# Altium schematic sheet Mach dieu khien tu xa.SchDoc: Bài 4: Mạch điều khiển từ xa
size A3; Revision: 1.0; SheetNumber: 01; SheetTotal: 02
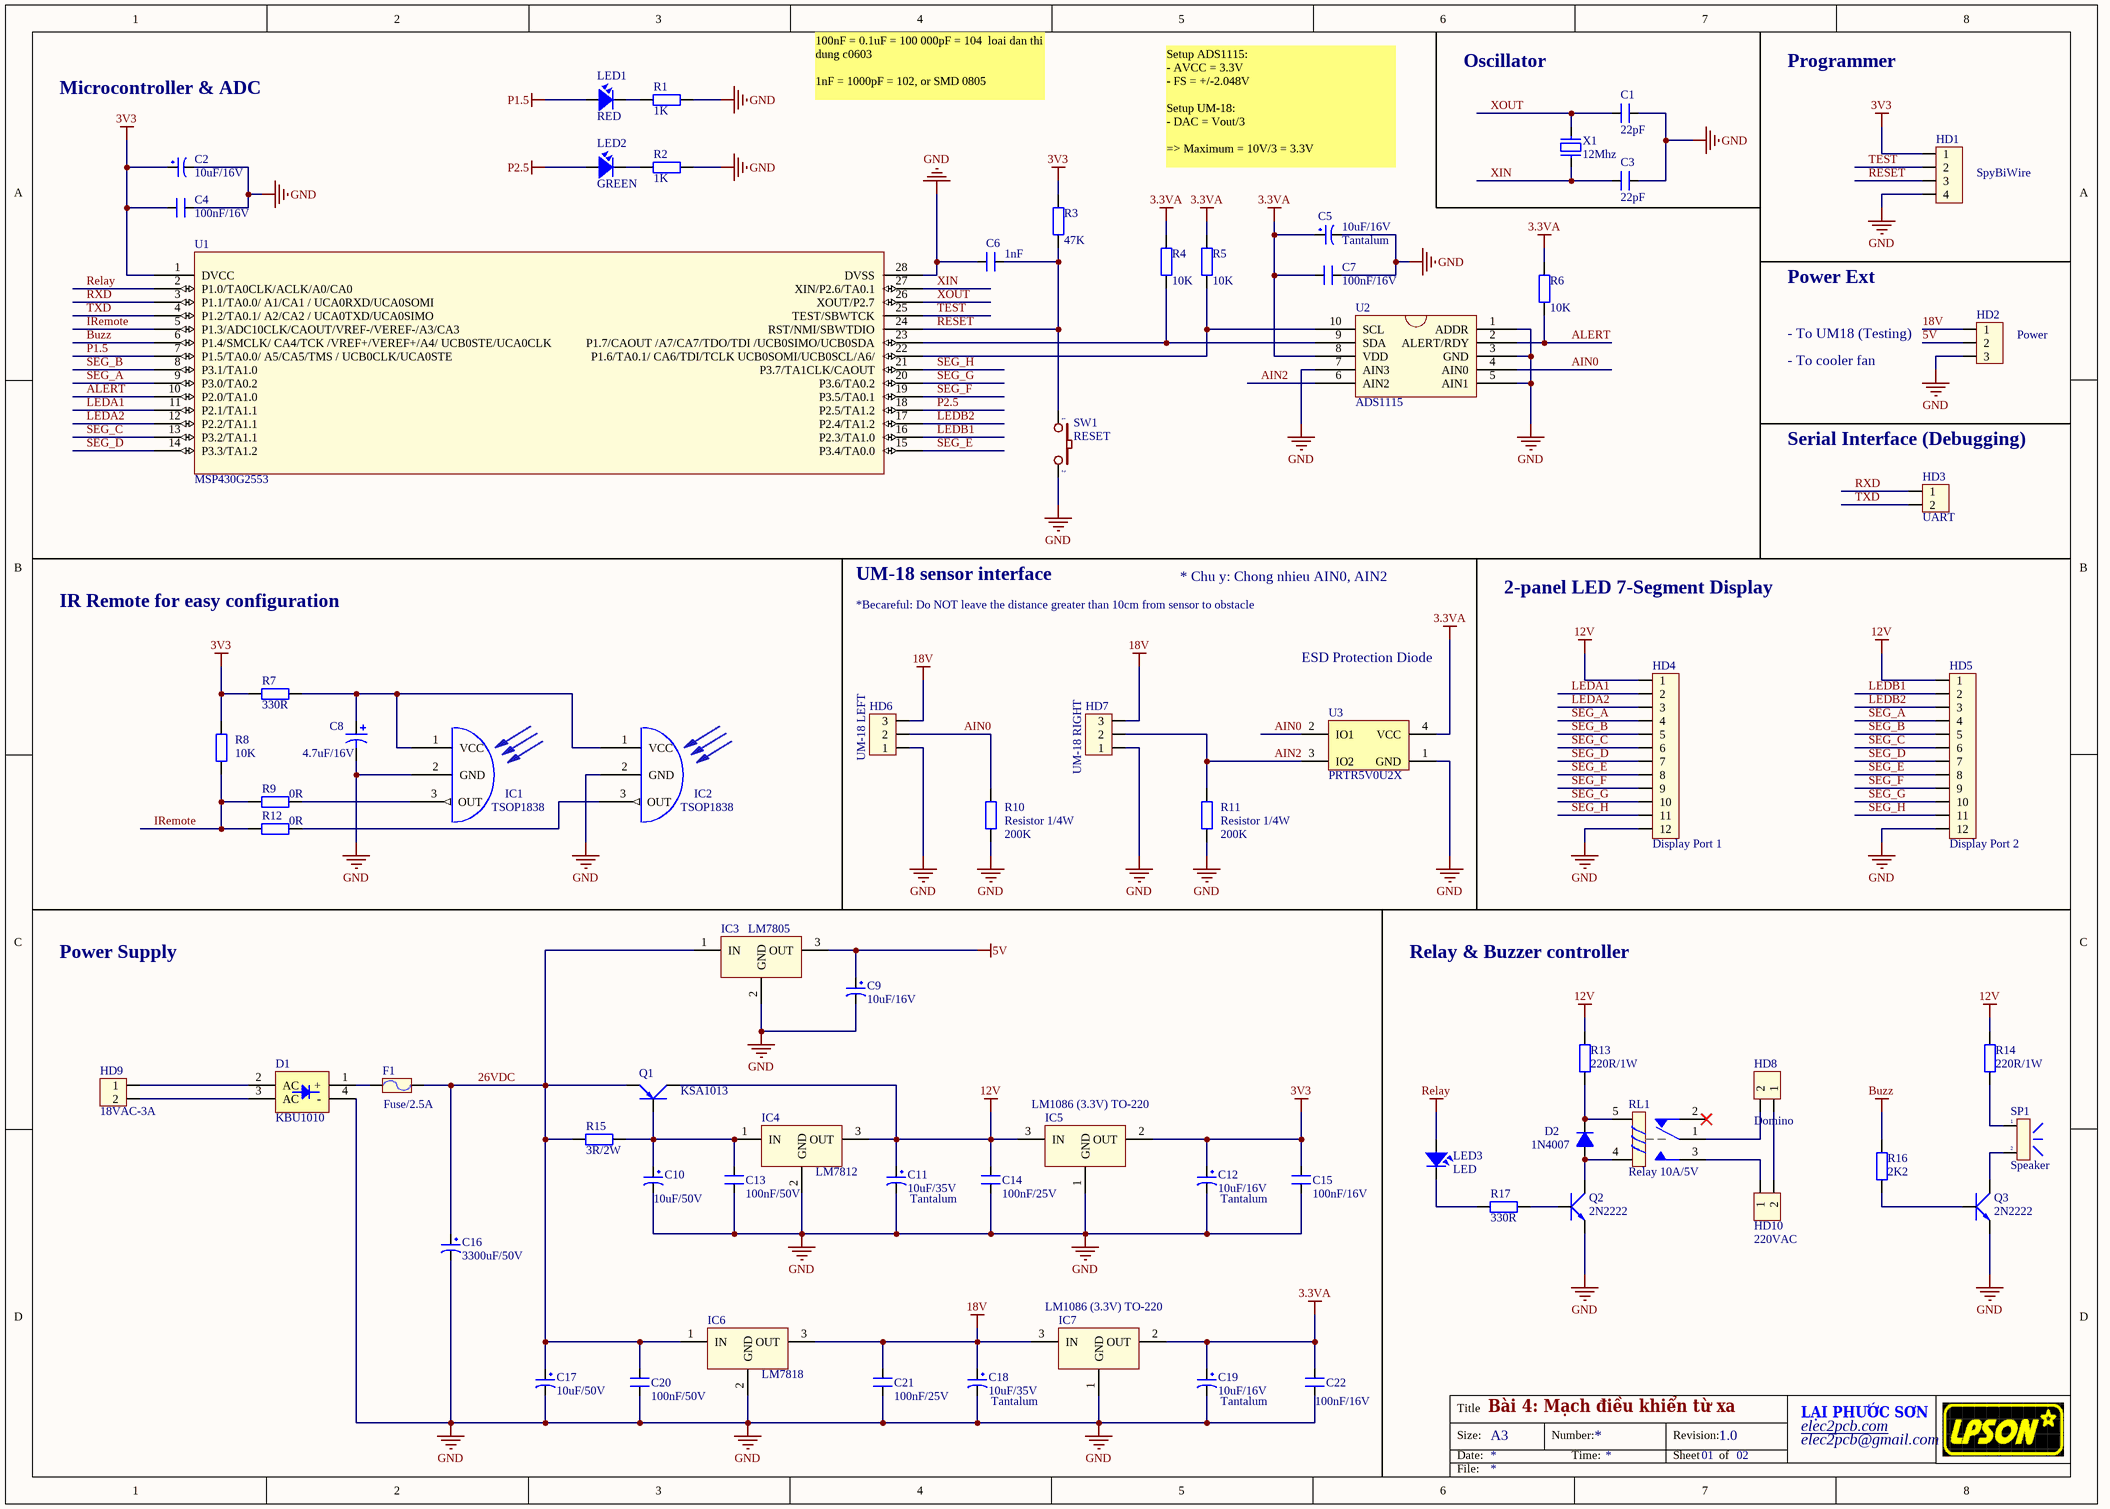
[diagram p0: Mach dieu khien tu xa.SchDoc]

## Parts
C1  22pF  [C0603]
C2  10uF/16V  [C0805]
C3  22pF  [C0603]
C4  100nF/16V  [Tu gom 104]
C5  10uF/16V  Type: Tantalum  [CAP_TANTA_10UF_16V]
C6  1nF  [C0805]
C7  100nF/16V  [Tu gom 104]
C8  value 4.7uF/16V  [C0805]  (hidden comment: Cap Pol1)
C9  10uF/16V  [CAP_10UF_16V]
C10  10uF/50V  [C_FC_10UF_50V]
C11  10uF/35V  Type: Tantalum  [CAP_TANTA_10UF_35V]
C12  10uF/16V  Type: Tantalum  [CAP_TANTA_10UF_16V]
C13  100nF/50V  [Tu gom 104]
C14  100nF/25V  [Tu gom 104]
C15  100nF/16V  [Tu gom 104]
C16  3300uF/50V  [CAP_3300UF_50V]
C17  10uF/50V  [C_FC_10UF_50V]
C18  10uF/35V  Type: Tantalum  [CAP_TANTA_10UF_35V]
C19  10uF/16V  Type: Tantalum  [CAP_TANTA_10UF_16V]
C20  100nF/50V  [Tu gom 104]
C21  100nF/25V  [Tu gom 104]
C22  100nF/16V  [Tu gom 104]
D1  KBU1010  [KBU1010G]
D2  1N4007  [1N4007]
F1  Fuse/2.5A  [FUSE2_5A]
HD1  SpyBiWire  [Header_4]
HD2  Power  [CON3]
HD3  UART  [Header_2]
HD4  Display Port 1  [CON12]
HD5  Display Port 2  [CON12]
HD6  UM-18 LEFT  [CON3]
HD7  UM-18 RIGHT  [CON3]
HD8  Domino  [DOMINO2_GREEN]
HD9  18VAC-3A  [DOMINO2_GREEN]
HD10  220VAC  [DOMINO2_GREEN]
IC1  TSOP1838  [TSOP1838]
IC2  TSOP1838  [TSOP1838]
IC3  LM7805  [LM7805]
IC4  LM7812  [LM7805]
IC5  LM1086 (3.3V) TO-220  [LM1086]
IC6  LM7818  [LM7805]
IC7  LM1086 (3.3V) TO-220  [LM1086]
LED1  RED  [LED3R]
LED2  GREEN  [LED3R]
LED3  LED  [LED3R]
Q1  KSA1013  [KSA1013]
Q2  2N2222  [2N2222]
Q3  2N2222  [2N2222]
R1  value 1K  [RESC2012(0805)]  (hidden comment: Res2)
R2  value 1K  [RESC2012(0805)]  (hidden comment: Res2)
R3  value 47K  [RESC2012(0805)]  (hidden comment: Res2)
R4  value 10K  [RESC2012(0805)]  (hidden comment: Res2)
R5  value 10K  [RESC2012(0805)]  (hidden comment: Res2)
R6  value 10K  [RESC2012(0805)]  (hidden comment: Res2)
R7  value 330R  [RESC2012(0805)]  (hidden comment: Res2)
R8  value 10K  [RESC2012(0805)]  (hidden comment: Res2)
R9  value 0R  [RESC2012(0805)]  (hidden comment: Res2)
R10  Resistor 1/4W  value 200K  [RESC2012(0805)]
R11  Resistor 1/4W  value 200K  [RESC2012(0805)]
R12  value 0R  [RESC2012(0805)]  (hidden comment: Res2)
R13  value 220R/1W  [CFR1WS]  (hidden comment: Res2)
R14  value 220R/1W  [CFR1WS]  (hidden comment: Res2)
R15  value 3R/2W  [R2WD]  (hidden comment: Res2)
R16  value 2K2  [RES 1/4W CFR25]  (hidden comment: Res2)
R17  value 330R  [RES 1/4W CFR25]  (hidden comment: Res2)
RL1  Relay 10A/5V  [RL_10A_5V]
SP1  Speaker  [SPEAKER]
SW1  RESET  [BUTTON 2PIN TRON]
U1  MSP430G2553  [MSP430G2253IPW28R]
U2  ADS1115  [ADS1115]
U3  PRTR5V0U2X  [PRTR5V0U2X]
X1  12Mhz  [CRYSTAL]

## Nets
3.3VA: C5.1 C7.2 C19.1 C22.2 IC7.2(OUT) R4.2 R5.2 R6.2 U2.8(VDD) U3.4(VCC)
3V3: C2.1 C4.2 C12.1 C15.2 HD1.1 IC5.2(OUT) R3.2 R7.2 R8.2 U1.1(DVCC)
5V: C9.1 HD2.2 IC3.3(OUT)
12V: C11.1 C14.2 HD4.1 HD5.1 IC4.3(OUT) IC5.3(IN) Q1.2(C) R13.1 R14.1
18V: C18.1 C21.2 HD2.1 HD6.3 HD7.3 IC6.3(OUT) IC7.3(IN)
Buzz: R16.1 U1.6(P1.4/SMCLK/_CA4/TCK_/VREF+/VEREF+/A4/_UCB0STE/UCA0CLK)
GND: C1.1 C2.2 C3.1 C4.1 C5.2 C6.1 C7.1 C8.2 C9.2 C10.2 C11.2 C12.2 C13.1 C14.1 C15.1 C16.2 C17.2 C18.2 C19.2 C20.1 C21.1 C22.1 D1.4(-) HD1.4 HD2.3 HD4.12 HD5.12 HD6.1 HD7.1 IC1.2(GND) IC2.2(GND) IC3.2(GND) IC4.2(GND) IC5.1(GND) IC6.2(GND) IC7.1(GND) Q2.1(E) Q3.1(E) R1.1 R2.1 R10.2 R11.2 SW1.2 U1.28(DVSS) U2.1(ADDR) U2.3(GND) U2.5(AIN1) U2.7(AIN3) U3.1(GND)
P1.5: LED1.1 U1.7(P1.5/TA0.0/_A5/CA5/TMS_/_UCB0CLK/UCA0STE)
P2.5: LED2.1 U1.18(P2.5/TA1.2)
Relay: LED3.1 U1.2(P1.0/TA0CLK/ACLK/A0/CA0)
26VDC: C16.1 C17.1 C20.2 F1.2 IC3.1(IN) IC6.1(IN) Q1.1(E) R15.2
AIN0: HD6.2 R10.1 U2.4(AIN0) U3.2(IO1)
AIN2: HD7.2 R11.1 U2.6(AIN2) U3.3(IO2)
ALERT: R6.1 U1.10(P2.0/TA1.0) U2.2(ALERT/RDY)
IRemote: R8.1 R9.2 R12.2 U1.5(P1.3/ADC10CLK/CAOUT/VREF-/VEREF-/A3/CA3)
LEDA1: HD4.2 U1.11(P2.1/TA1.1)
LEDA2: HD4.3 U1.12(P2.2/TA1.1)
LEDB1: HD5.2 U1.16(P2.3/TA1.0)
LEDB2: HD5.3 U1.17(P2.4/TA1.2)
RESET: C6.2 HD1.3 R3.1 SW1.1 U1.24(RST/NMI/SBWTDIO)
RXD: HD3.1 U1.3(P1.1/TA0.0/_A1/CA1_/_UCA0RXD/UCA0SOMI)
SEG_A: HD4.4 HD5.4 U1.9(P3.0/TA0.2)
SEG_B: HD4.5 HD5.5 U1.8(P3.1/TA1.0)
SEG_C: HD4.6 HD5.6 U1.13(P3.2/TA1.1)
SEG_D: HD4.7 HD5.7 U1.14(P3.3/TA1.2)
SEG_E: HD4.8 HD5.8 U1.15(P3.4/TA0.0)
SEG_F: HD4.9 HD5.9 U1.19(P3.5/TA0.1)
SEG_G: HD4.10 HD5.10 U1.20(P3.6/TA0.2)
SEG_H: HD4.11 HD5.11 U1.21(P3.7/TA1CLK/CAOUT)
TEST: HD1.2 U1.25(TEST/SBWTCK)
TXD: HD3.2 U1.4(P1.2/TA0.1/_A2/CA2_/_UCA0TXD/UCA0SIMO)
XIN: C3.2 U1.27(XIN/P2.6/TA0.1) X1.2
XOUT: C1.2 U1.26(XOUT/P2.7) X1.1
NetC8_1: C8.1 IC1.1(VCC) IC2.1(VCC) R7.1
NetC10_1: C10.1 C13.2 IC4.1(IN) Q1.3(B) R15.1
NetD1_1: D1.1(+) F1.1
NetD1_2: D1.2(AC) HD9.1
NetD1_3: D1.3(AC) HD9.2
NetD2_1: D2.1(A) Q2.3(C) RL1.4
NetD2_2: D2.2(K) R13.2 RL1.5
NetHD8_1: HD8.1 HD10.2
NetHD8_2: HD8.2 RL1.1
NetHD10_1: HD10.1 RL1.3
NetIC1_3: IC1.3(OUT) R9.1
NetIC2_3: IC2.3(OUT) R12.1
NetLED1_2: LED1.2 R1.2
NetLED2_2: LED2.2 R2.2
NetLED3_2: LED3.2 R17.2
NetQ2_2: Q2.2(B) R17.1
NetQ3_2: Q3.2(B) R16.2
NetQ3_3: Q3.3(C) SP1.2
NetR4_1: R4.1 U1.23(P1.7/CAOUT_/A7/CA7/TDO/TDI_/UCB0SIMO/UCB0SDA) U2.9(SDA)
NetR5_1: R5.1 U1.22(P1.6/TA0.1/_CA6/TDI/TCLK_UCB0SOMI/UCB0SCL/A6/) U2.10(SCL)
NetR14_2: R14.2 SP1.1

Not connected (* = marked no-connect by the designer): RL1 2*

## Notes on the sheet
- Microcontroller & ADC
- 100nF = 0.1uF = 100 000pF = 104  loai dan thi dung c0603
  1nF = 1000pF = 102, or SMD 0805
- Oscillator
- Programmer
- Setup ADS1115:
  - AVCC = 3.3V
  - FS = +/-2.048V
  Setup UM-18:
  - DAC = Vout/3
  => Maximum = 10V/3 = 3.3V
- Power Ext
- (near HD2) - To UM18 (Testing)
- - To cooler fan
- (near HD3) Serial Interface (Debugging)
- UM-18 sensor interface
- * Chu y: Chong nhieu AIN0, AIN2
- IR Remote for easy configuration
- *Becareful: Do NOT leave the distance greater than 10cm from sensor to obstacle
- 2-panel LED 7-Segment Display
- ESD Protection Diode
- Power Supply
- Relay & Buzzer controller
- Title
- Size:
- Date:
- A3
- Number:
- Time:
- Revision:
- Sheet
- of
- LẠI PHƯỚC SƠN
- elec2pcb@gmail.com
- elec2pcb.com
- File:

## Library data of the parts
C1 C3 = CN1: 0805-SMD Capacitor; Value: 22pF
C2 C16 = CP1: Cap P  0,1uF < 22uF , 16 - 50V; Value: 10uF/50V; Description 1: 10 => 220uF/6,3V/10V - 10uF => 100uF/16V; Description 2: 0,1uF => 33uF/50V - 10uF => 22uF/63V; Description 3: 0,47uF => 10uF/100V
C4 C7 C13-C15 C20-C22 = CN2: Cap np 104 => 105pF; Value: 0.1uF
C5 C11 C12 C18 C19 = CP1: Tantalum Capacitor; datasheet: http://www.kemet.com/Lists/ProductCatalog/Attachments/254/KEM_T2005_T491.pdf
  C5 C12 C19: digikey: http://www.digikey.com/product-detail/en/T491A106M016AT/399-3687-1-ND/819012
  C11 C18: digikey: http://www.digikey.com/product-detail/en/T491C106K025AT/399-3734-1-ND/819059
C6 = CN2: Cap np 104 => 105pF; Value: 1nF
C8 = Cap Pol1: Polarized Capacitor (Radial); Published: 8-Jun-2000; LatestRevisionDate: 17-Jul-2002; LatestRevisionNote: Re-released for DXP Platform.; PackageReference: RB7.6-15; Publisher: Altium Limited; PackageDescription: Polarized Capacitor (Radial); 2 Leads
C9 C17 = CP1: Aluminium Capacitor
C10 = CP1: Aluminium Capacitor; Description 1: 10 => 220uF/6,3V/10V - 10uF => 100uF/16V; Description 2: 0,1uF => 33uF/50V - 10uF => 22uF/63V; Description 3: 0,47uF => 10uF/100V
D1 = KBU1010: 10A glass passivated bridge rectifier; Digikey: http://www.digikey.com/product-detail/en/KBU1010-G/641-1359-ND/2074824; datasheet: http://www.comchiptech.com/cms/UserFiles/KBU10005-G%20Thru.%20KBU1010-G%20Series%20RevA.pdf
D2 = D1A: Diode 1A; Value: 1N4007
F1 = Fuse: Designed by: VanDungEvn; Value: Fuse
HD1 = Hed4: Header 4 (Green); Value: Header 4
HD2 HD6 HD7 = Hed3: Header 3 (Green); Value: Header 3
HD3 HD8-HD10 = Hed2: Header 2 (Green); Value: Header 2
HD4 HD5 = Hed12: Header 12; Value: Header 5
IC3 IC5-IC7 = LM78xx: Linear Regulator
  IC3: Value: LM7805; digikey: http://www.digikey.com/product-detail/en/LM7805CT/LM7805CT-ND/458698; datasheet: http://www.fairchildsemi.com/ds/LM/LM7805.pdf
  IC5 IC7: Value: LM1086 (3.3V); digikey: http://www.digikey.com/product-detail/en/LM1086CSX-3.3%2FNOPB/LM1086CSX-3.3%2FNOPBCT-ND/3440095; datasheet: http://www.ti.com/lit/ds/symlink/lm1086.pdf
  IC6: Value: LM7818; digikey: http://www.digikey.com/product-detail/en/LM7818CT/LM7818CT-ND/1923054; datasheet: http://www.fairchildsemi.com/ds/LM/LM7805.pdf
IC4 = LM78xx: Linear Regulator; Manufacturer: Fairchild Semiconductor; Value: LM7812; Digikey: http://www.digikey.com/product-detail/en/LM7812ACT/LM7812ACT-ND/1923050; Datasheet: http://www.fairchildsemi.com/ds/LM/LM7805.pdf
LED1-LED3 = LED: LED Single colour Green and Red; Value: LED 3 ly Single Colour
Q1 = A1015: PNP 600mW, ECB; Manufacturer: Fairchild Semiconductor; Value: KSA1013; Digikey: http://www.digikey.com/product-detail/en/KSA1013YBU/KSA1013YBUFS-ND/1048937; Datasheet: http://www.fairchildsemi.com/ds/KS/KSA1013.pdf
Q2 Q3 = C1815: TRANS GP SS NPN LP 40V TO92; Value: P2N2222AG; digikey: http://www.digikey.com/product-detail/en/P2N2222AG/P2N2222AGOS-ND/920244
R1-R9 R12-R17 = Res2: Resistor; Published: 8-Jun-2000; LatestRevisionDate: 17-Jul-2002; LatestRevisionNote: Re-released for DXP Platform.; PackageReference: AXIAL-0.4; Publisher: Altium Limited; PackageDescription: Axial Device, Thru-Hole; 2 Leads; 0.4 in Pin Spacing
R10 R11 = Res2: digikey: http://www.digikey.com/product-detail/en/MFP-25BRD52-100K/100KADCT-ND/2059112; datasheet: http://www.yageo.com/documents/recent/General%20Type_MFP.pdf
RL1 = Relay 1: Relay SPDT,10A - 12VDC 5 Pin; Value: Relay SPDT, 10A, 12V
SP1 = SPK: Speaker Chip; Value: Speaker Chip
SW1 = SW2: Switch button 2 pin; Value: SW chip 2 pin
U1 = MSP430G2553: MSP430G2553 (28 pins); Digikey: http://www.digikey.com/product-detail/en/MSP430G2553IPW28R/296-28431-1-ND/2638890; Datasheet: http://www.ti.com/lit/ds/symlink/msp430g2553.pdf
U2 = ADS1115: Analog to Digital Converter; Digikey: http://www.digikey.com/product-detail/en/ADS1115IDGST/296-24934-1-ND/2123298; Datasheet: http://www.ti.com/lit/ds/symlink/ads1113.pdf
U3 = PRTR5V0U2X: ESD protection diode; digikey: http://www.digikey.com/product-detail/en/PRTR5V0U2X,215/568-4140-1-ND/1589981; datasheet: http://www.nxp.com/documents/data_sheet/PRTR5V0U2X.pdf
X1 = XT2: Crystal For all Crystal 2pin.; Value: 4Mhz